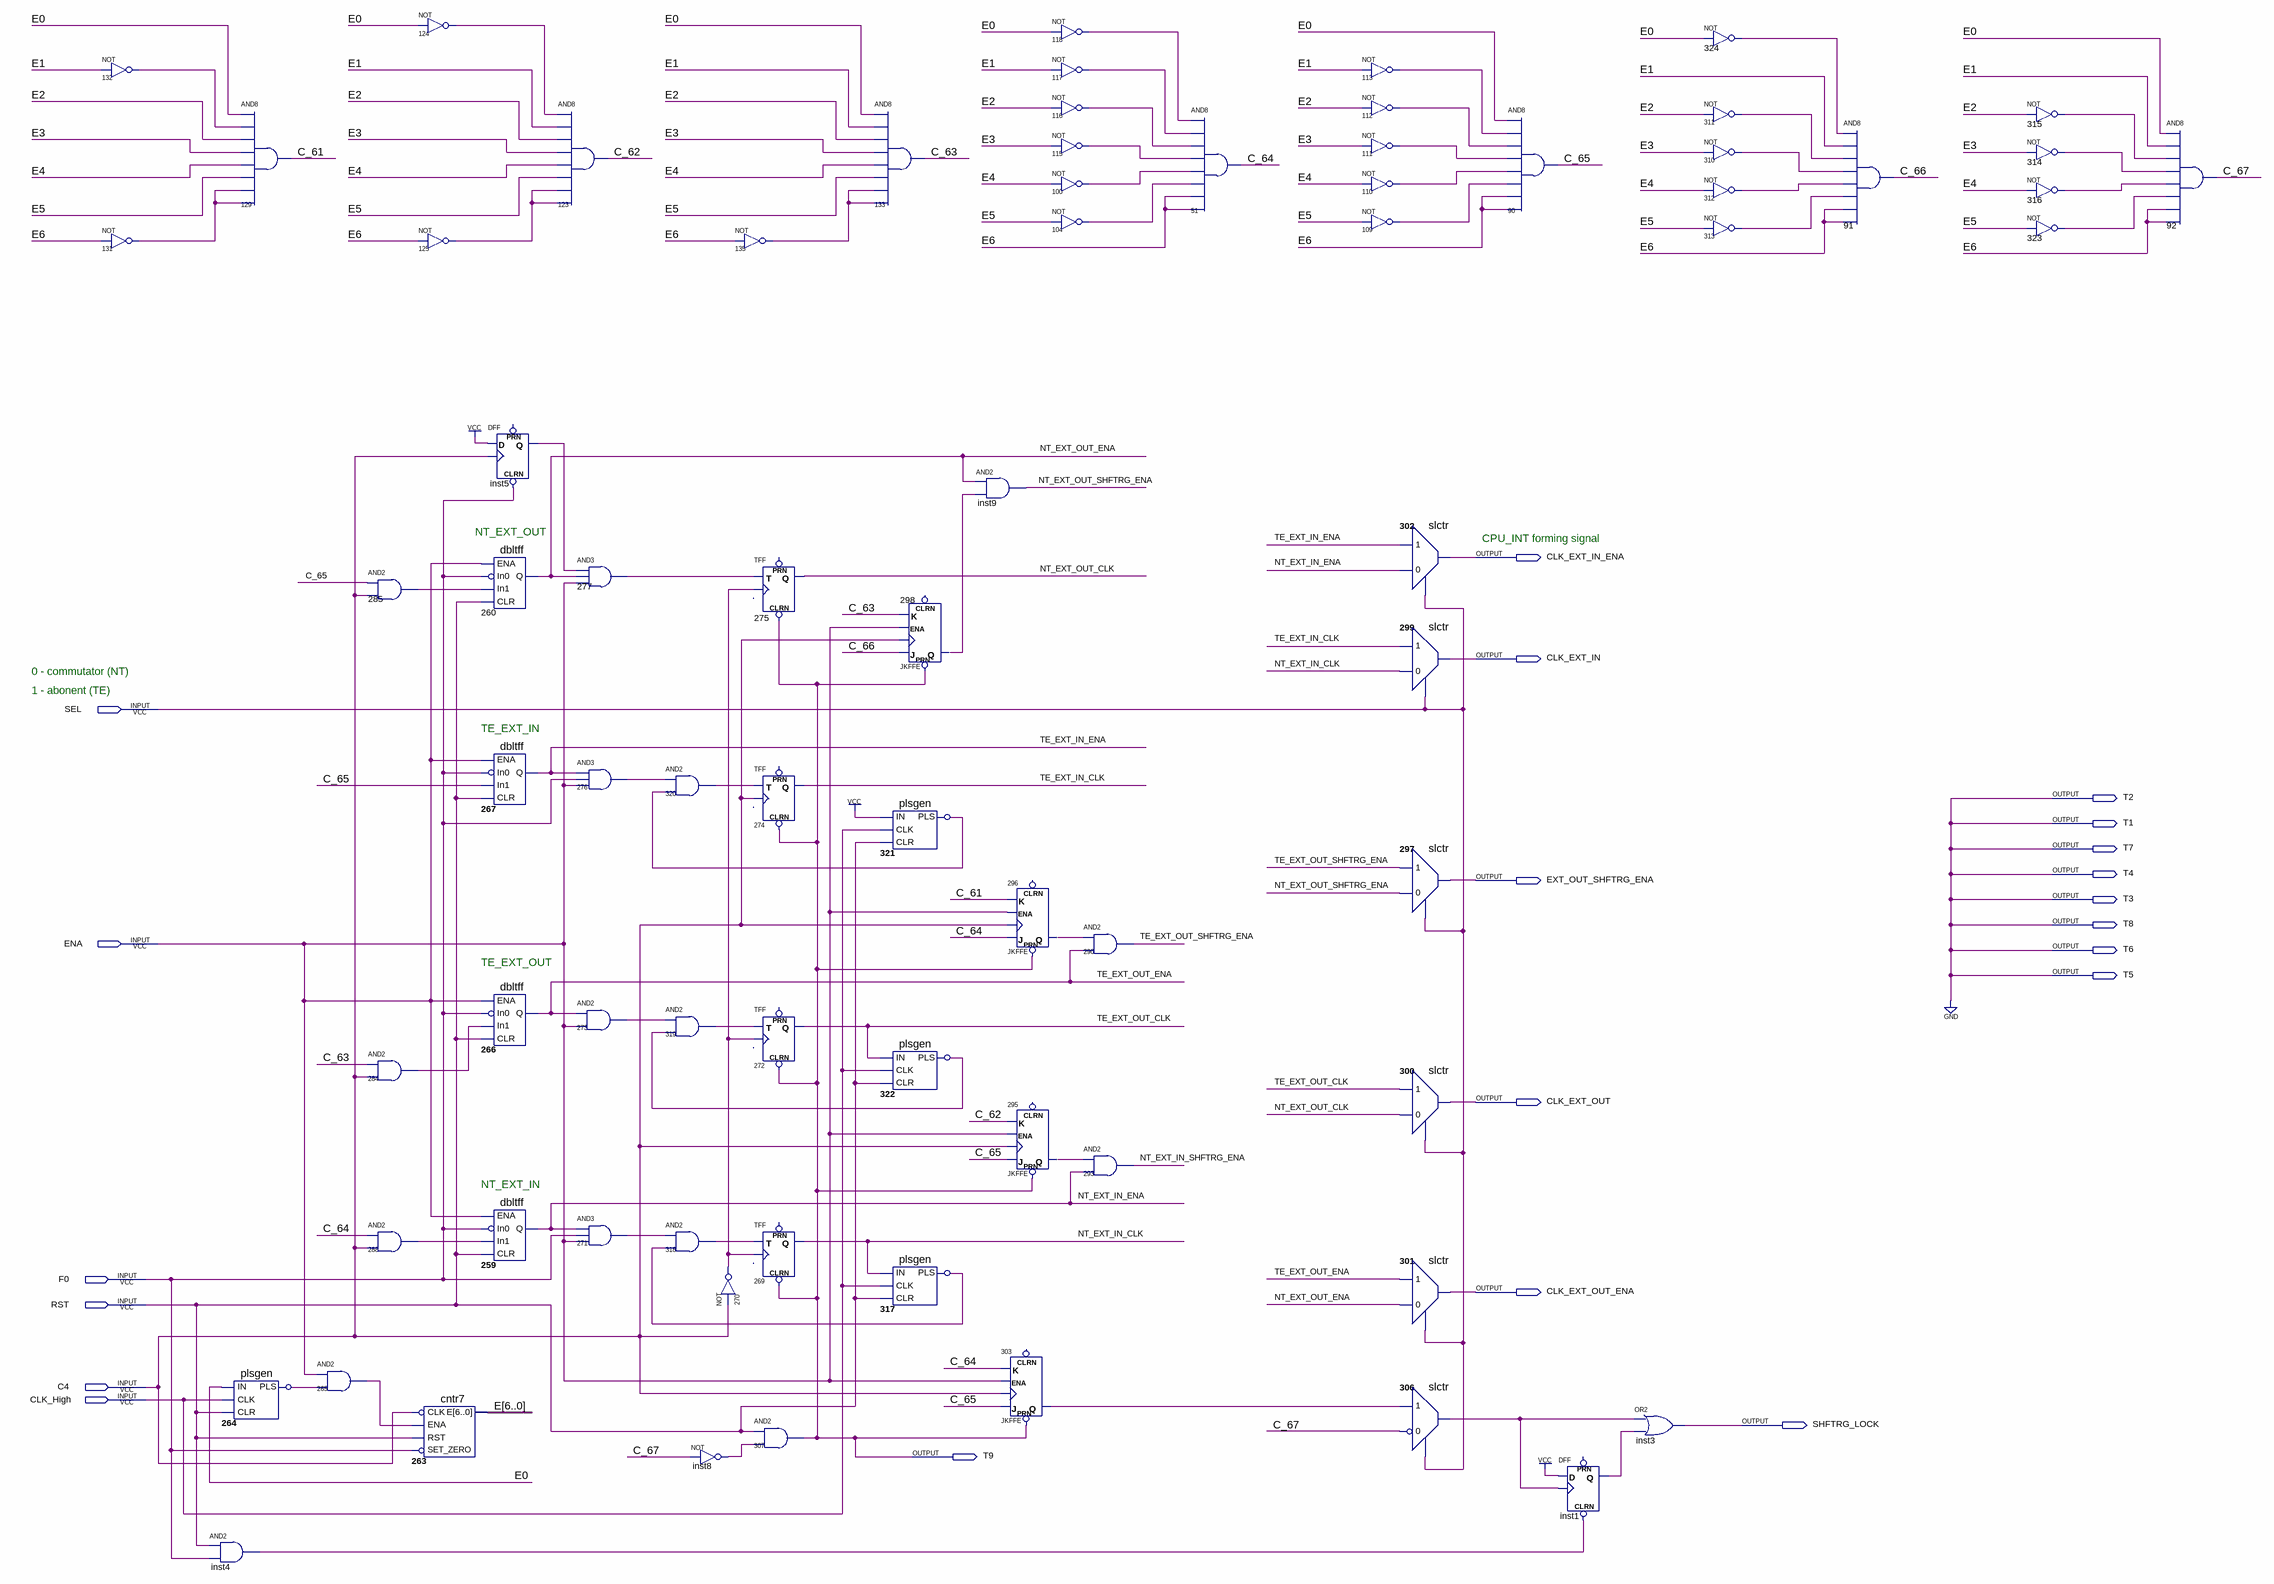
[diagram p0: schematic sheet]
// Quartus schematic shrg_ctrl3.bdf as structural Verilog: 76 symbols, 21 pins
module shrg_ctrl3 (
  input  SEL,
  input  ENA,
  input  F0,
  input  RST,
  input  C4,
  input  CLK_High,
  output CLK_EXT_IN_ENA,
  output CLK_EXT_IN,
  output T2,
  output T1,
  output T7,
  output T4,
  output EXT_OUT_SHFTRG_ENA,
  output T3,
  output T8,
  output T6,
  output T5,
  output CLK_EXT_OUT,
  output CLK_EXT_OUT_ENA,
  output SHFTRG_LOCK,
  output T9
);

  wire C_61, C_62, C_63, C_64, C_65, C_66, C_67, inst1_q, inst4_out, inst5_q, inst8_out, n100_out, n104_out,
       n109_out, n110_out, n111_out, n112_out, n113_out, n115_out, n116_out, n117_out, n118_out, n124_out,
       n125_out, n131_out, n132_out, n135_out, n264_pls, n264_PLS_inverted_out, n265_out, n270_out, n271_out,
       n273_out, n276_out, n277_out, n284_out, n285_out, n288_out, n295_q, n296_q, n298_q, n303_q, n306_out,
       n310_out, n311_out, n312_out, n313_out, n314_out, n315_out, n316_out, n317_pls, n317_PLS_inverted_out,
       n318_out, n319_out, n320_out, n321_pls, n321_PLS_inverted_out, n322_pls, n322_PLS_inverted_out,
       n323_out, n324_out, NT_EXT_IN_CLK, NT_EXT_IN_ENA, NT_EXT_IN_SHFTRG_ENA, NT_EXT_OUT_CLK,
       NT_EXT_OUT_ENA, NT_EXT_OUT_SHFTRG_ENA, TE_EXT_IN_CLK, TE_EXT_IN_ENA, TE_EXT_OUT_CLK, TE_EXT_OUT_ENA,
       TE_EXT_OUT_SHFTRG_ENA;
  wire [6:0] E;

  not u_132 (n132_out, E[1]);
  not u_131 (n131_out, E[6]);
  and inst4 (inst4_out, RST, F0);
  and u_129 (C_61, E[0], n132_out, E[2], E[3], E[4], E[5], n131_out, n131_out);
  plsgen u_264 (.IN(E[0]), .CLK(CLK_High), .CLR(RST), .PLS(n264_pls));
  not u_264_PLS_inverted (n264_PLS_inverted_out, n264_pls);
  and u_265 (n265_out, ENA, n264_PLS_inverted_out);
  and u_285 (n285_out, C_65, C4);
  and u_284 (n284_out, C_63, C4);
  and u_288 (n288_out, C_64, C4);
  not u_124 (n124_out, E[0]);
  not u_125 (n125_out, E[6]);
  cntr7 u_263 (.CLK(~C4), .ENA(n265_out), .RST(RST), .SET_ZERO(~F0), .E(E));
  DFF inst5 (.CLRN(F0), .CLK(C4), .D(1'b1), .Q(inst5_q));  // open: PRN
  dbltff u_260 (.ENA(ENA), .In0(~F0), .In1(n285_out), .CLR(RST), .Q(NT_EXT_OUT_ENA));
  dbltff u_267 (.ENA(ENA), .In0(~F0), .In1(C_65), .CLR(RST), .Q(TE_EXT_IN_ENA));
  dbltff u_266 (.ENA(ENA), .In0(~F0), .In1(n284_out), .CLR(RST), .Q(TE_EXT_OUT_ENA));
  dbltff u_259 (.ENA(ENA), .In0(~F0), .In1(n288_out), .CLR(RST), .Q(NT_EXT_IN_ENA));
  and u_123 (C_62, n124_out, E[1], E[2], E[3], E[4], E[5], n125_out, n125_out);
  and u_277 (n277_out, inst5_q, NT_EXT_OUT_ENA, ENA);
  and u_276 (n276_out, TE_EXT_IN_ENA, F0, ENA);
  and u_273 (n273_out, TE_EXT_OUT_ENA, ENA);
  and u_271 (n271_out, NT_EXT_IN_ENA, F0, ENA);
  and u_320 (n320_out, n276_out, n321_PLS_inverted_out);
  and u_319 (n319_out, n273_out, n322_PLS_inverted_out);
  and u_318 (n318_out, n271_out, n317_PLS_inverted_out);
  not u_270 (n270_out, C4);
  not inst8 (inst8_out, C_67);
  not u_135 (n135_out, E[6]);
  TFF u_275 (.CLRN(T9), .T(n277_out), .CLK(n270_out), .Q(NT_EXT_OUT_CLK));  // open: PRN
  TFF u_274 (.CLRN(T9), .T(n320_out), .CLK(C4), .Q(TE_EXT_IN_CLK));  // open: PRN
  TFF u_272 (.CLRN(T9), .T(n319_out), .CLK(n270_out), .Q(TE_EXT_OUT_CLK));  // open: PRN
  TFF u_269 (.CLRN(T9), .T(n318_out), .CLK(n270_out), .Q(NT_EXT_IN_CLK));  // open: PRN
  and u_307 (T9, RST, inst8_out);
  and u_133 (C_63, E[0], E[1], E[2], E[3], E[4], E[5], n135_out, n135_out);
  JKFFE u_298 (.PRN(T9), .J(C_66), .CLK(C4), .K(C_63), .ENA(ENA), .Q(n298_q));  // open: CLRN
  plsgen u_321 (.IN(1'b1), .CLK(CLK_High), .CLR(RST), .PLS(n321_pls));
  not u_321_PLS_inverted (n321_PLS_inverted_out, n321_pls);
  plsgen u_322 (.IN(TE_EXT_OUT_CLK), .CLK(CLK_High), .CLR(RST), .PLS(n322_pls));
  not u_322_PLS_inverted (n322_PLS_inverted_out, n322_pls);
  plsgen u_317 (.IN(NT_EXT_IN_CLK), .CLK(CLK_High), .CLR(RST), .PLS(n317_pls));
  not u_317_PLS_inverted (n317_PLS_inverted_out, n317_pls);
  and inst9 (NT_EXT_OUT_SHFTRG_ENA, NT_EXT_OUT_ENA, n298_q);
  JKFFE u_296 (.PRN(T9), .J(C_64), .CLK(C4), .K(C_61), .ENA(ENA), .Q(n296_q));  // open: CLRN
  JKFFE u_295 (.PRN(T9), .J(C_65), .CLK(C4), .K(C_62), .ENA(ENA), .Q(n295_q));  // open: CLRN
  JKFFE u_303 (.PRN(T9), .J(C_65), .CLK(C4), .K(C_64), .ENA(ENA), .Q(n303_q));  // open: CLRN
  not u_118 (n118_out, E[0]);
  not u_117 (n117_out, E[1]);
  not u_116 (n116_out, E[2]);
  not u_115 (n115_out, E[3]);
  not u_100 (n100_out, E[4]);
  not u_104 (n104_out, E[5]);
  and u_290 (TE_EXT_OUT_SHFTRG_ENA, n296_q, TE_EXT_OUT_ENA);
  and u_293 (NT_EXT_IN_SHFTRG_ENA, n295_q, NT_EXT_IN_ENA);
  and u_51 (C_64, n118_out, n117_out, n116_out, n115_out, n100_out, n104_out, E[6], E[6]);
  not u_113 (n113_out, E[1]);
  not u_112 (n112_out, E[2]);
  not u_111 (n111_out, E[3]);
  not u_110 (n110_out, E[4]);
  not u_109 (n109_out, E[5]);
  slctr u_302 (.SEL(SEL), .In0(NT_EXT_IN_ENA), .In1(TE_EXT_IN_ENA), .Out(CLK_EXT_IN_ENA));
  slctr u_299 (.SEL(SEL), .In0(NT_EXT_IN_CLK), .In1(TE_EXT_IN_CLK), .Out(CLK_EXT_IN));
  slctr u_297 (.SEL(SEL), .In0(NT_EXT_OUT_SHFTRG_ENA), .In1(TE_EXT_OUT_SHFTRG_ENA), .Out(EXT_OUT_SHFTRG_ENA));
  slctr u_300 (.SEL(SEL), .In0(NT_EXT_OUT_CLK), .In1(TE_EXT_OUT_CLK), .Out(CLK_EXT_OUT));
  slctr u_301 (.SEL(SEL), .In0(NT_EXT_OUT_ENA), .In1(TE_EXT_OUT_ENA), .Out(CLK_EXT_OUT_ENA));
  slctr u_306 (.SEL(SEL), .In0(~C_67), .In1(n303_q), .Out(n306_out));
  and u_90 (C_65, E[0], n113_out, n112_out, n111_out, n110_out, n109_out, E[6], E[6]);
  DFF inst1 (.CLRN(inst4_out), .CLK(n306_out), .D(1'b1), .Q(inst1_q));  // open: PRN
  or inst3 (SHFTRG_LOCK, n306_out, inst1_q);
  not u_324 (n324_out, E[0]);
  not u_311 (n311_out, E[2]);
  not u_310 (n310_out, E[3]);
  not u_312 (n312_out, E[4]);
  not u_313 (n313_out, E[5]);
  and u_91 (C_66, n324_out, E[1], n311_out, n310_out, n312_out, n313_out, E[6], E[6]);
  not u_315 (n315_out, E[2]);
  not u_314 (n314_out, E[3]);
  not u_316 (n316_out, E[4]);
  not u_323 (n323_out, E[5]);
  and u_92 (C_67, E[0], E[1], n315_out, n314_out, n316_out, n323_out, E[6], E[6]);

  assign T1 = 1'b0;
  assign T2 = 1'b0;
  assign T3 = 1'b0;
  assign T4 = 1'b0;
  assign T5 = 1'b0;
  assign T6 = 1'b0;
  assign T7 = 1'b0;
  assign T8 = 1'b0;

  // Notes on the sheet:
  //   NT_EXT_OUT
  //   CPU_INT forming signal
  //   0 - commutator (NT)
  //   1 - abonent (TE)
  //   TE_EXT_IN
  //   TE_EXT_OUT
  //   NT_EXT_IN
endmodule
